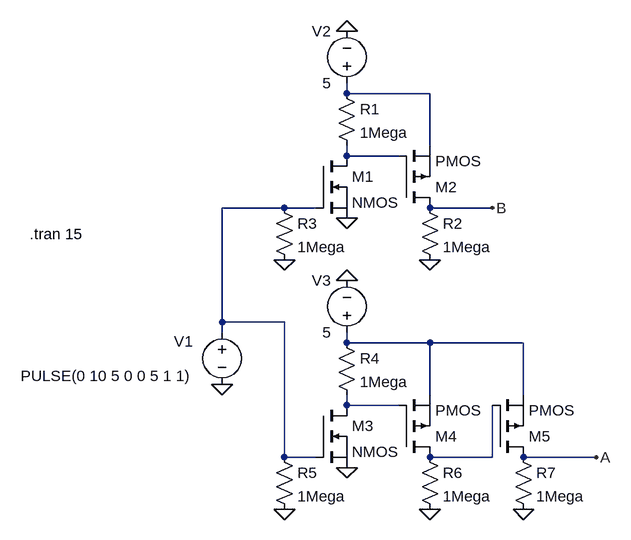
[diagram p0: schematic 5V_Source_Switcher.asc]
5V_Source_Switcher.asc, the LTspice schematic file:
Version 4
SHEET 1 880 692
WIRE 304 32 304 16
WIRE 432 32 304 32
WIRE 432 112 432 32
WIRE 304 128 304 112
WIRE 384 128 304 128
WIRE 208 208 112 208
WIRE 256 208 208 208
WIRE 528 208 432 208
WIRE 112 384 112 208
WIRE 208 384 112 384
WIRE 112 400 112 384
WIRE 304 416 304 400
WIRE 432 416 304 416
WIRE 576 416 432 416
WIRE 432 496 432 416
WIRE 576 496 576 416
WIRE 304 512 304 496
WIRE 384 512 304 512
WIRE 208 592 208 384
WIRE 256 592 208 592
WIRE 528 592 528 512
WIRE 528 592 432 592
WIRE 688 592 576 592
FLAG 112 480 0
FLAG 304 224 0
FLAG 304 -64 0
FLAG 432 288 0
FLAG 208 288 0
FLAG 304 608 0
FLAG 304 320 0
FLAG 432 672 0
FLAG 208 672 0
FLAG 576 672 0
FLAG 688 592 A
FLAG 528 208 B
SYMBOL voltage 112 384 R0
WINDOW 0 -74 30 Left 2
WINDOW 3 -310 83 Left 2
WINDOW 123 0 0 Left 0
WINDOW 39 0 0 Left 0
SYMATTR InstName V1
SYMATTR Value PULSE(0 10 5 0 0 5 1 1)
SYMBOL nmos 256 128 R0
SYMATTR InstName M1
SYMBOL voltage 304 32 R180
WINDOW 0 24 96 Left 2
WINDOW 3 24 16 Left 2
SYMATTR InstName V2
SYMATTR Value 5
SYMBOL res 288 16 R0
SYMATTR InstName R1
SYMATTR Value 1Mega
SYMBOL pmos 384 208 M180
SYMATTR InstName M2
SYMBOL res 192 192 R0
SYMATTR InstName R3
SYMATTR Value 1Mega
SYMBOL res 416 192 R0
SYMATTR InstName R2
SYMATTR Value 1Mega
SYMBOL nmos 256 512 R0
SYMATTR InstName M3
SYMBOL voltage 304 416 R180
WINDOW 0 24 96 Left 2
WINDOW 3 24 16 Left 2
SYMATTR InstName V3
SYMATTR Value 5
SYMBOL res 288 400 R0
SYMATTR InstName R4
SYMATTR Value 1Mega
SYMBOL pmos 384 592 M180
SYMATTR InstName M4
SYMBOL res 192 576 R0
SYMATTR InstName R5
SYMATTR Value 1Mega
SYMBOL res 416 576 R0
SYMATTR InstName R6
SYMATTR Value 1Mega
SYMBOL pmos 528 592 M180
SYMATTR InstName M5
SYMBOL res 560 576 R0
SYMATTR InstName R7
SYMATTR Value 1Mega
TEXT -184 248 Left 2 !.tran 15

The netlist it stands for:
* 5V_Source_Switcher.asc
V1 N003 0 PULSE(0 10 5 0 0 5 1 1)
M1 N002 N003 0 0 NMOS
V2 N001 0 5
R1 N001 N002 1Mega
M2 B N002 N001 N001 PMOS
R3 N003 0 1Mega
R2 B 0 1Mega
M3 N005 N003 0 0 NMOS
V3 N004 0 5
R4 N004 N005 1Mega
M4 N006 N005 N004 N004 PMOS
R5 N003 0 1Mega
R6 N006 0 1Mega
M5 A N006 N004 N004 PMOS
R7 A 0 1Mega
.model NMOS NMOS
.model PMOS PMOS
.lib standard.mos
.tran 15
.backanno
.end